# EAGLE design pro-one-mix-and-modified-noise_2 (EAGLE 5.07)
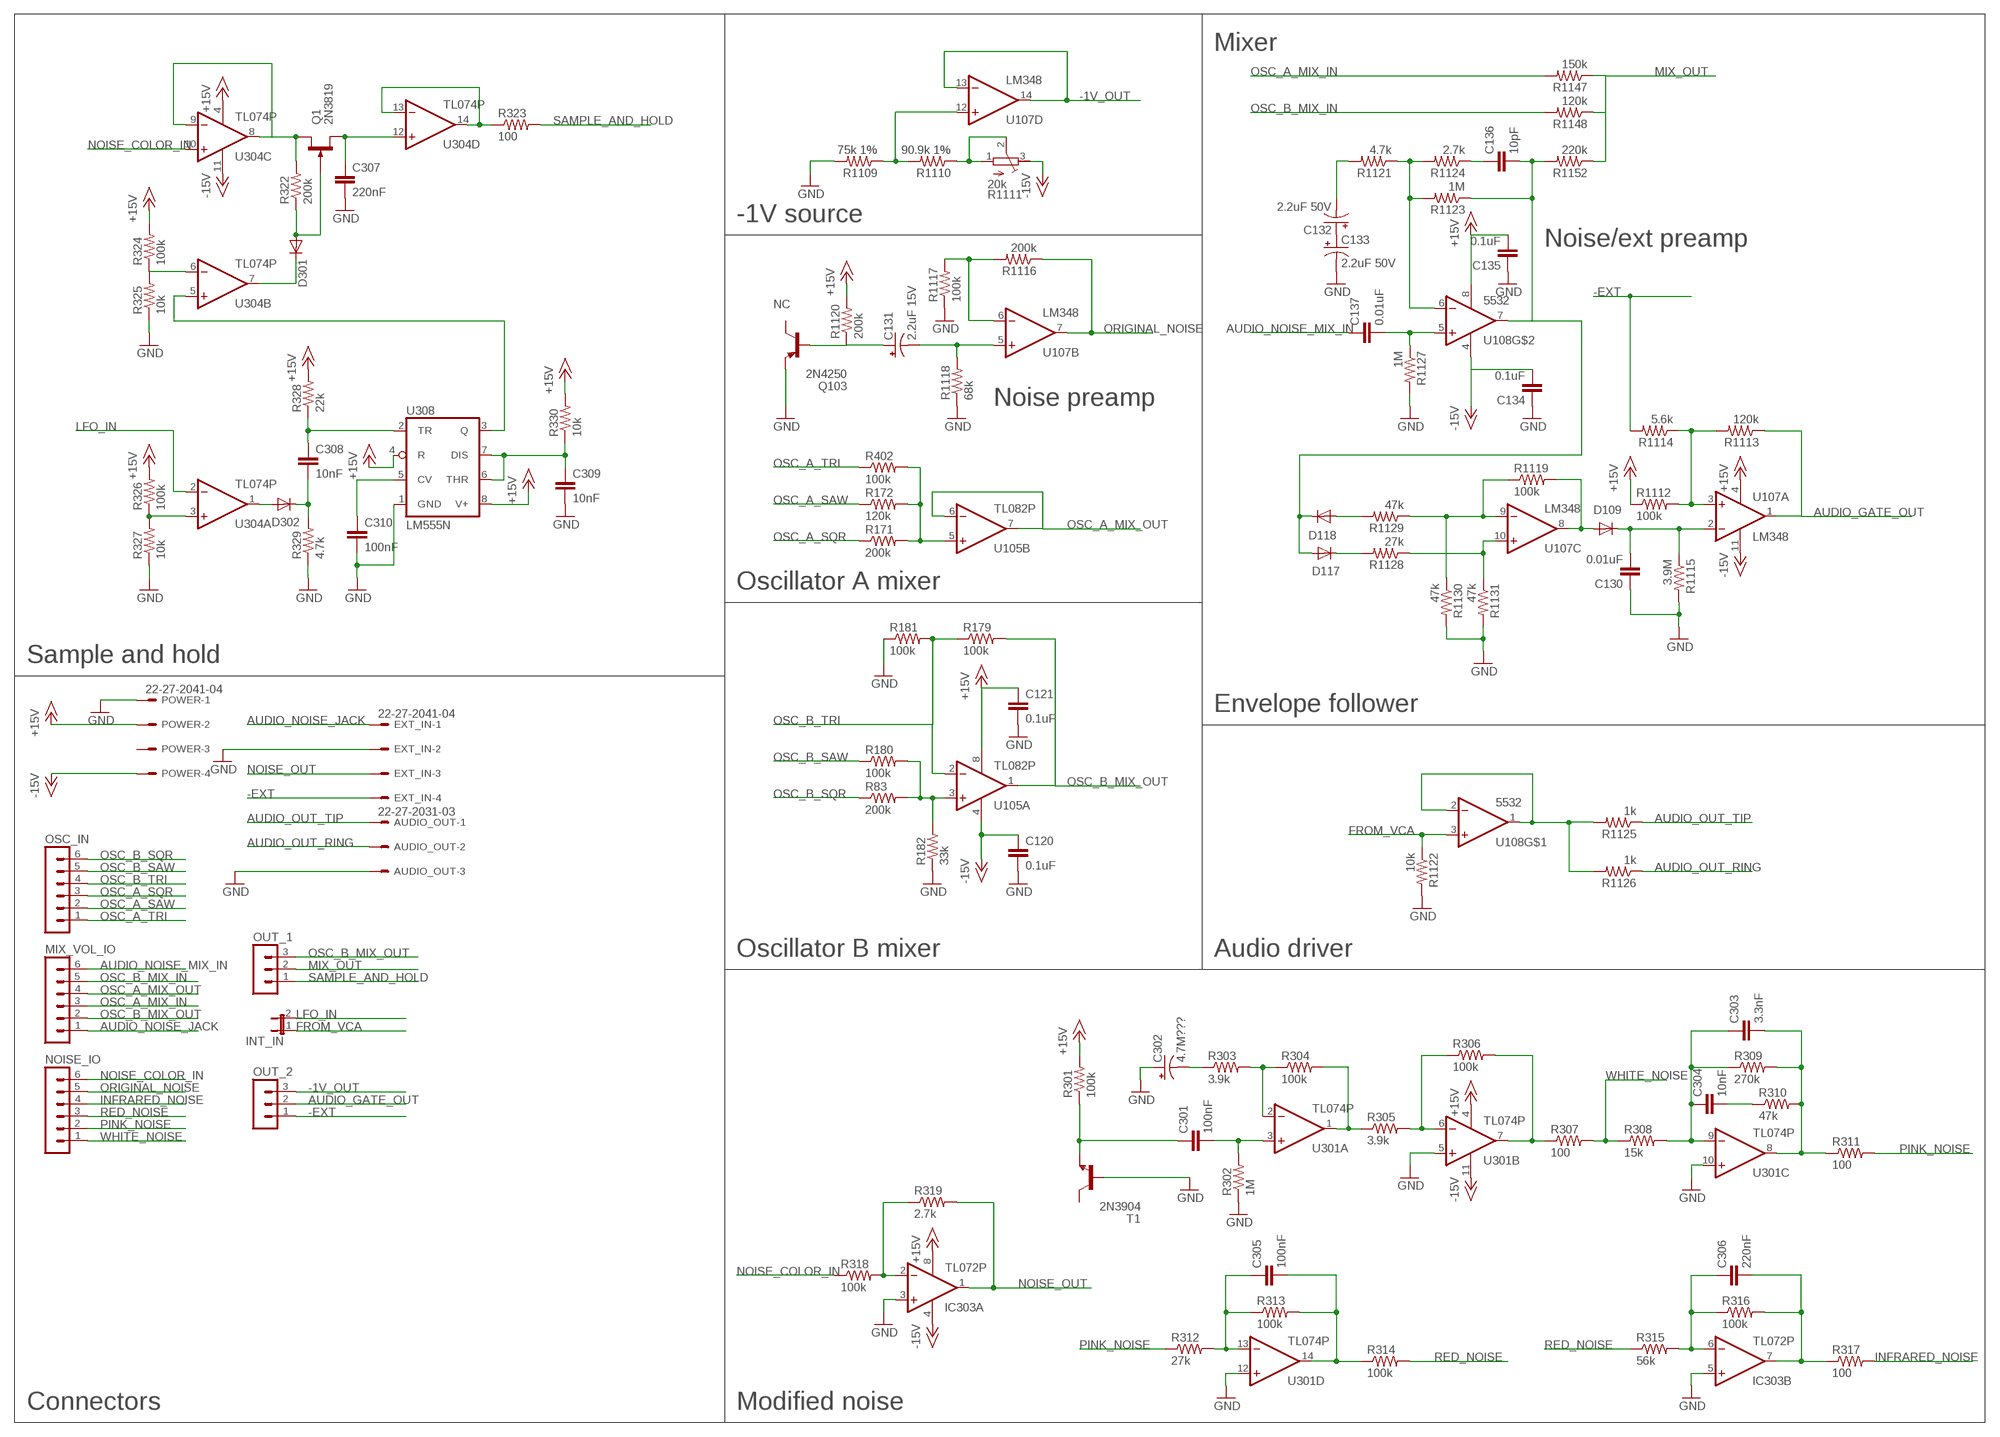
[diagram p0: schematic, sheet 1]

## Parts
AUDIO_OUT  22-27-2031-03  [6410-03]
C120  0.1uF  C-EU050-025X075  [C050-025X075]
C121  0.1uF  C-EU050-025X075  [C050-025X075]
C130  0.01uF  C-EU050-025X075  [C050-025X075]
C131  2.2uF 15V  CPOL-USE2.5-5  [E2,5-5]
C132  2.2uF 50V  CPOL-USE2.5-5  [E2,5-5]
C133  2.2uF 50V  CPOL-USE2.5-5  [E2,5-5]
C134  0.1uF  C-EU050-025X075  [C050-025X075]
C135  0.1uF  C-EU050-025X075  [C050-025X075]
C136  10pF  C-EU050-025X075  [C050-025X075]
C137  0.01uF  C-EU050-025X075  [C050-025X075]
C301  100nF  C-EU050-025X075  [C050-025X075]
C302  4.7M???  CPOL-USE2.5-5  [E2,5-5]
C303  3.3nF  C-EU050-025X075  [C050-025X075]
C304  10nF  C-EU050-025X075  [C050-025X075]
C305  100nF  C-EU050-025X075  [C050-025X075]
C306  220nF  C-EU050-025X075  [C050-025X075]
C307  220nF  C-EU050-025X075  [C050-025X075]
C308  10nF  C-EU050-025X075  [C050-025X075]
C309  10nF  C-EU050-025X075  [C050-025X075]
C310  100nF  C-EU050-025X075  [C050-025X075]
D109  1N4148DO35-7  [DO35-7]
D117  1N4148DO35-7  [DO35-7]
D118  1N4148DO35-7  [DO35-7]
D301  1N4148DO35-7  [DO35-7]
D302  1N4148DO35-7  [DO35-7]
EXT_IN  22-27-2041-04  [6410-04]
IC303  TL072P  [DIL08]
INT_IN  JP1E  [JP1]
MIX_VOL_IO  MA06-1  [MA06-1]
NOISE_IO  MA06-1  [MA06-1]
OSC_IN  MA06-1  [MA06-1]
OUT_1  MA03-1  [MA03-1]
OUT_2  MA03-1  [MA03-1]
POWER  22-27-2041-04  [6410-04]
Q1  2N3819  [TO92F]
Q103  2N4250  [TO92]
R83  200k  R-US_0309/10  [0309/10]
R171  200k  R-US_0309/10  [0309/10]
R172  120k  R-US_0309/10  [0309/10]
R179  100k  R-US_0309/10  [0309/10]
R180  100k  R-US_0309/10  [0309/10]
R181  100k  R-US_0309/10  [0309/10]
R182  33k  R-US_0309/10  [0309/10]
R301  100k  R-US_0309/10  [0309/10]
R302  1M  R-US_0309/10  [0309/10]
R303  3.9k  R-US_0309/10  [0309/10]
R304  100k  R-US_0309/10  [0309/10]
R305  3.9k  R-US_0309/10  [0309/10]
R306  100k  R-US_0309/10  [0309/10]
R307  100  R-US_0309/10  [0309/10]
R308  15k  R-US_0309/10  [0309/10]
R309  270k  R-US_0309/10  [0309/10]
R310  47k  R-US_0309/10  [0309/10]
R311  100  R-US_0309/10  [0309/10]
R312  27k  R-US_0309/10  [0309/10]
R313  100k  R-US_0309/10  [0309/10]
R314  100k  R-US_0309/10  [0309/10]
R315  56k  R-US_0309/10  [0309/10]
R316  100k  R-US_0309/10  [0309/10]
R317  100  R-US_0309/10  [0309/10]
R318  100k  R-US_0309/10  [0309/10]
R319  2.7k  R-US_0309/10  [0309/10]
R322  200k  R-US_0309/10  [0309/10]
R323  100  R-US_0309/10  [0309/10]
R324  100k  R-US_0309/10  [0309/10]
R325  10k  R-US_0309/10  [0309/10]
R326  100k  R-US_0309/10  [0309/10]
R327  10k  R-US_0309/10  [0309/10]
R328  22k  R-US_0309/10  [0309/10]
R329  4.7k  R-US_0309/10  [0309/10]
R330  10k  R-US_0309/10  [0309/10]
R402  100k  R-US_0309/10  [0309/10]
R1109  75k 1%  R-US_0309/10  [0309/10]
R1110  90.9k 1%  R-US_0309/10  [0309/10]
R1111  20k  R-TRIMM64W  [RTRIM64W]
R1112  100k  R-US_0309/10  [0309/10]
R1113  120k  R-US_0309/10  [0309/10]
R1114  5.6k  R-US_0309/10  [0309/10]
R1115  3.9M  R-US_0309/10  [0309/10]
R1116  200k  R-US_0309/10  [0309/10]
R1117  100k  R-US_0309/10  [0309/10]
R1118  68k  R-US_0309/10  [0309/10]
R1119  100k  R-US_0309/10  [0309/10]
R1120  200k  R-US_0309/10  [0309/10]
R1121  4.7k  R-US_0309/10  [0309/10]
R1122  10k  R-US_0309/10  [0309/10]
R1123  1M  R-US_0309/10  [0309/10]
R1124  2.7k  R-US_0309/10  [0309/10]
R1125  1k  R-US_0309/10  [0309/10]
R1126  1k  R-US_0309/10  [0309/10]
R1127  1M  R-US_0309/10  [0309/10]
R1128  27k  R-US_0309/10  [0309/10]
R1129  47k  R-US_0309/10  [0309/10]
R1130  47k  R-US_0309/10  [0309/10]
R1131  47k  R-US_0309/10  [0309/10]
R1147  150k  R-US_0309/10  [0309/10]
R1148  120k  R-US_0309/10  [0309/10]
R1152  220k  R-US_0309/10  [0309/10]
T1  2N3904  [TO92]
U105  TL082P  [DIL08]
U107  LM348  [DIL14]
U108  5532  [DIL08]
U301  TL074P  [DIL14]
U304  TL074P  [DIL14]
U308  LM555N  [DIL08]

## Nets
+15V: C121.1 C135.2 IC303.8(P:V+) POWER.2 R301.2 R324.2 R326.2 R328.2 R330.2 R1112.1 R1120.2 U105.8(P:V+) U107.4(P:V+) U108.8(V+) U301.4(P:V+) U304.4(P:V+) U308.4(R) U308.8(V+)
-1V_OUT: OUT_2.3 U107.13(D:-IN) U107.14(D:OUT)
-15V: C120.1 C134.2 IC303.4(P:V-) POWER.4 R1111.3(A) U105.4(P:V-) U107.11(P:V-) U108.4(V-) U301.11(P:V-) U304.11(P:V-)
-EXT: EXT_IN.4 OUT_2.1 R1114.2
AUDIO_GATE_OUT: OUT_2.2 R1113.1 U107.1(A:OUT)
AUDIO_NOISE_JACK: EXT_IN.1 MIX_VOL_IO.1
AUDIO_NOISE_MIX_IN: C137.1 MIX_VOL_IO.6
AUDIO_OUT_RING: AUDIO_OUT.2 R1126.1
AUDIO_OUT_TIP: AUDIO_OUT.1 R1125.1
FROM_VCA: INT_IN.1 R1122.1 U108.3(+IN)
GND: AUDIO_OUT.3 C120.2 C121.2 C130.1 C133.- C134.1 C135.1 C302.+ C307.2 C309.2 C310.2 EXT_IN.2 IC303.3(A:+IN) IC303.5(B:+IN) POWER.1 Q103.3(E) R181.1 R182.1 R302.1 R325.1 R327.1 R329.1 R1109.2 R1115.2 R1117.1 R1118.1 R1122.2 R1127.2 R1130.2 R1131.2 T1.2(B) U301.5(B:+IN) U301.10(C:+IN) U301.12(D:+IN) U308.1(GND)
INFRARED_NOISE: NOISE_IO.4 R317.2
LFO_IN: INT_IN.2 U304.2(A:-IN)
MIX_OUT: OUT_1.2 R1147.1 R1148.1 R1152.1
N$1: R171.2 R172.2 R402.2 U105.5(B:+IN)
N$2: R83.2 R180.2 R182.2 U105.3(A:+IN)
N$3: C131.- R1118.2 U107.5(B:+IN)
N$4: C131.+ Q103.2(B) R1120.1
N$5: R1116.2 R1117.2 U107.6(B:-IN)
N$6: C132.+ C133.+
N$7: R1109.1 R1110.2 U107.12(D:+IN)
N$8: R1110.1 R1111.1(E) R1111.2(S)
N$9: C132.- R1121.2
N$10: D118.A R1129.2
N$11: C136.1 R1124.1
N$12: C136.2 D117.A D118.C R1123.1 R1152.2 U108.7(OUT)
N$13: C137.2 R1127.1 U108.5(+IN)
N$14: R1121.1 R1123.2 R1124.2 U108.6(-IN)
N$15: D117.C R1128.2
N$16: R1119.1 R1129.1 R1130.1 U107.9(C:-IN)
N$17: R1128.1 R1131.1 U107.10(C:+IN)
N$18: R1112.2 R1113.2 R1114.1 U107.3(A:+IN)
N$19: R1125.2 R1126.2 U108.1(OUT) U108.2(-IN)
N$20: C301.1 R301.1 T1.3(E)
N$21: D109.A R1119.2 U107.8(C:OUT)
N$22: C130.2 D109.C R1115.1 U107.2(A:-IN)
N$23: C301.2 R302.2 U301.3(A:+IN)
N$24: C302.- R303.1
N$25: R303.2 R304.1 U301.2(A:-IN)
N$26: R304.2 R305.1 U301.1(A:OUT)
N$27: R305.2 R306.1 U301.6(B:-IN)
N$28: C305.1 R312.2 R313.1 U301.13(D:-IN)
N$29: R306.2 R307.1 U301.7(B:OUT)
N$30: C305.2 R313.2 R314.1 U301.14(D:OUT)
N$31: C303.1 C304.1 R308.2 R309.1 U301.9(C:-IN)
N$32: C306.1 IC303.6(B:-IN) R315.2 R316.1
N$33: C304.2 R310.1
N$34: C303.2 R309.2 R310.2 R311.1 U301.8(C:OUT)
N$35: C306.2 IC303.7(B:OUT) R316.2 R317.1
N$36: R324.1 R325.2 U304.6(B:-IN)
N$37: IC303.2(A:-IN) R318.2 R319.1
N$38: R326.1 R327.2 U304.3(A:+IN)
N$39: D302.A U304.1(A:OUT)
N$40: C308.2 D302.C R329.2
N$41: C308.1 R328.1 U308.2(TR)
N$42: U304.5(B:+IN) U308.3(Q)
N$43: C310.1 U308.5(CV)
N$44: C309.1 R330.1 U308.6(THR) U308.7(DIS)
N$45: D301.C U304.7(B:OUT)
N$46: D301.A Q1.G R322.1
N$47: Q1.D R322.2 U304.8(C:OUT) U304.9(C:-IN)
N$48: C307.1 Q1.S U304.12(D:+IN)
N$49: R323.1 U304.13(D:-IN) U304.14(D:OUT)
NOISE_COLOR_IN: NOISE_IO.6 R318.1 U304.10(C:+IN)
NOISE_OUT: EXT_IN.3 IC303.1(A:OUT) R319.2
ORIGINAL_NOISE: NOISE_IO.5 R1116.1 U107.7(B:OUT)
OSC_A_MIX_IN: MIX_VOL_IO.3 R1147.2
OSC_A_MIX_OUT: MIX_VOL_IO.4 U105.6(B:-IN) U105.7(B:OUT)
OSC_A_SAW: OSC_IN.2 R172.1
OSC_A_SQR: OSC_IN.3 R171.1
OSC_A_TRI: OSC_IN.1 R402.1
OSC_B_MIX_IN: MIX_VOL_IO.5 R1148.2
OSC_B_MIX_OUT: MIX_VOL_IO.2 OUT_1.3 R179.2 U105.1(A:OUT)
OSC_B_SAW: OSC_IN.5 R180.1
OSC_B_SQR: OSC_IN.6 R83.1
OSC_B_TRI: OSC_IN.4 R179.1 R181.2 U105.2(A:-IN)
PINK_NOISE: NOISE_IO.2 R311.2 R312.1
RED_NOISE: NOISE_IO.3 R314.2 R315.1
SAMPLE_AND_HOLD: OUT_1.1 R323.2
WHITE_NOISE: NOISE_IO.1 R307.2 R308.1
Unconnected: POWER.3 Q103.1(C) T1.1(C)

## Notes on the sheet
- Mixer
- -1V source
- Noise/ext preamp
- NC
- Noise preamp
- Oscillator A mixer
- Sample and hold
- Envelope follower
- Oscillator B mixer | Audio driver
- Connectors | Modified noise

## Library data of the parts
AUDIO_OUT = con-molex:22-?-03: CONNECTOR wire to board 2.54 mm (.1 inch) pitch header
C120 C121 C130 C134-C137 C301 C303-C310 = resistor:C-EU: CAPACITOR, European symbol
C131-C133 C302 = rcl:CPOL-US: POLARIZED CAPACITOR, American symbol
D109 D117 D118 D301 D302 = diode:1N4148: DIODE high speed (Philips)
EXT_IN POWER = con-molex:22-?-04: CONNECTOR wire to board 2.54 mm (.1 inch) pitch header
IC303 = linear:TL072: OP AMP
INT_IN = jumper:JP1E: JUMPER
MIX_VOL_IO NOISE_IO OSC_IN = con-lstb:MA06-1: PIN HEADER
OUT_1 OUT_2 = con-lstb:MA03-1: PIN HEADER
Q1 = transistor-small-signal:2N3819: N-CHANNEL FET
Q103 = joakim:2N4250: PNP Transistor
R83 R171 R172 R179-R182 R301-R319 R322-R330 R402 R1109 R1110 R1112-R1131 R1147 R1148 R1152 = resistor:R-US_: RESISTOR, American symbol
R1111 = resistor:R-TRIMM: Trimm resistor
T1 = transistor:2N3904: NPN TRANSISTOR
U105 = linear:TL082: OP AMP
U107 = joakim:LM348: Quad General Purpose, Low Voltage, Operational Amplifiers
U108 = joakim:5532: DUAL LOW-NOISE OPERATIONAL AMPLIFIERS
U301 U304 = linear:TL074: OP AMP
U308 = linear:*555: TIMER

## Board
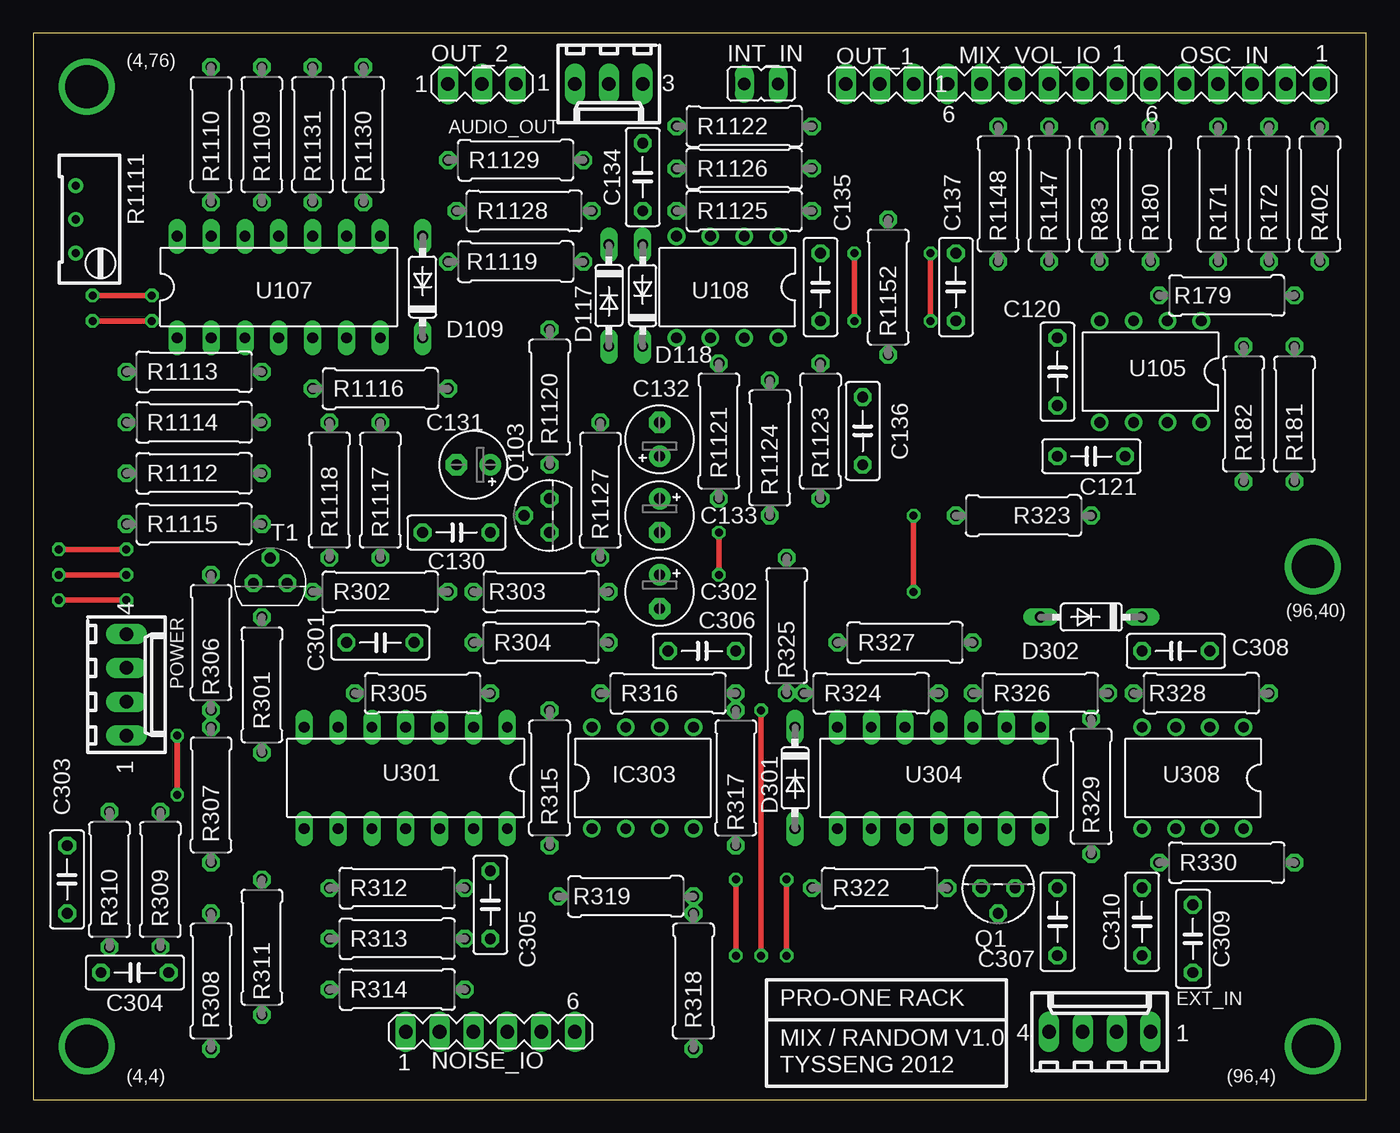
[diagram p1: board, top side]
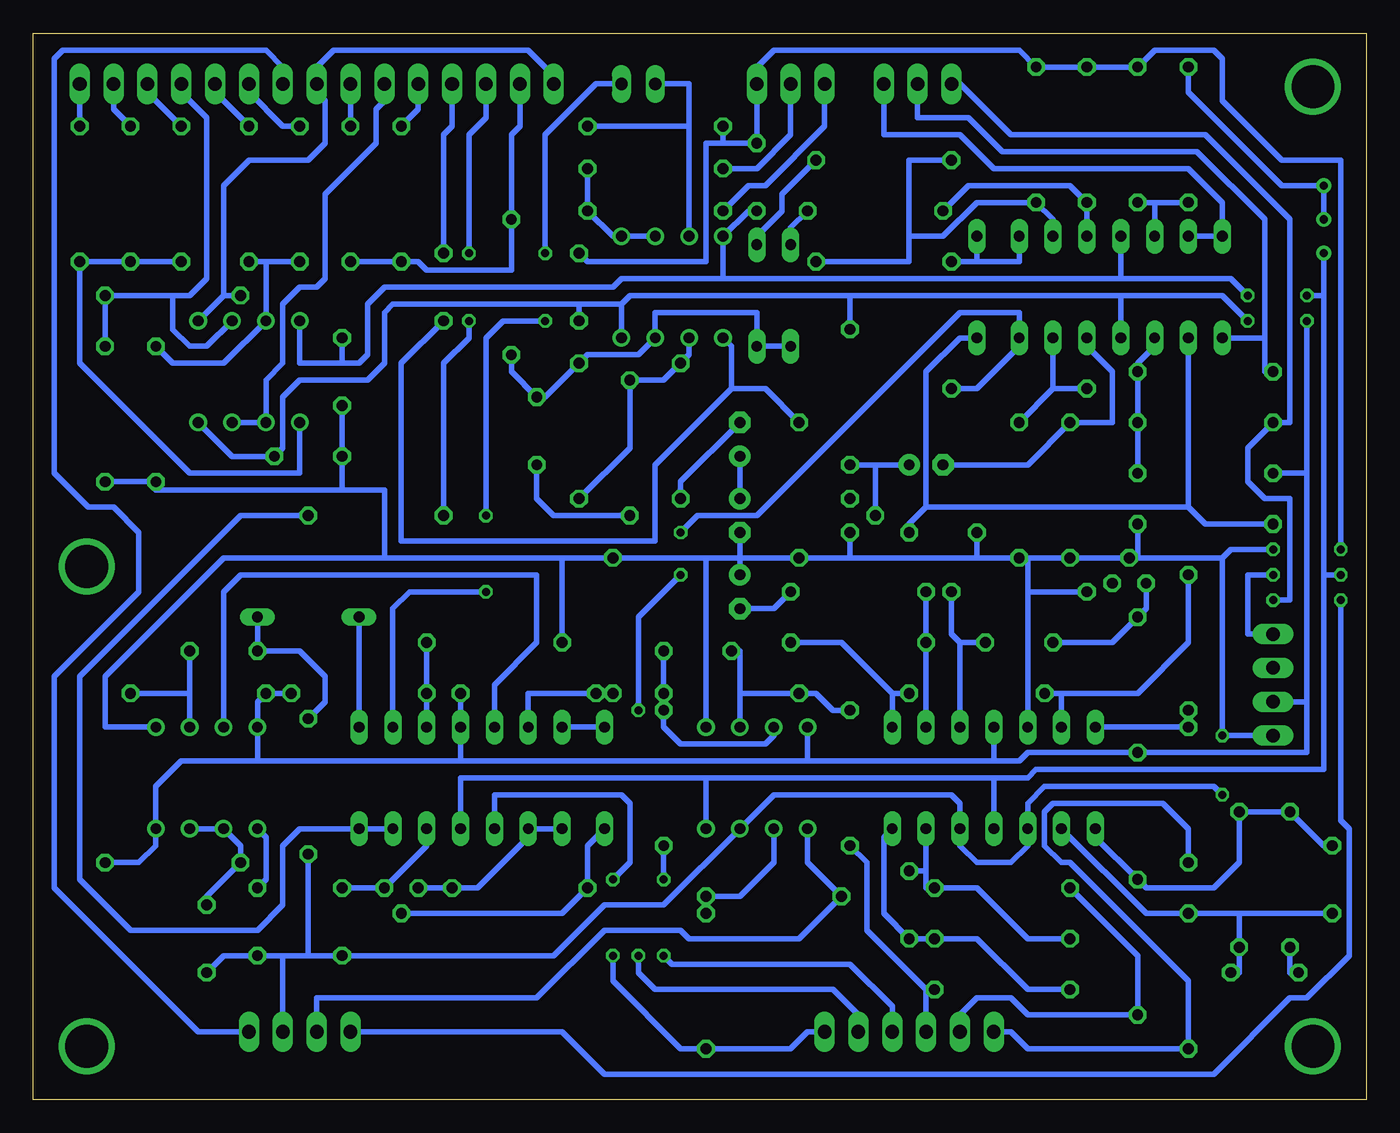
[diagram p2: board, bottom side, seen from below]

Size 100 x 80 mm. Coordinates in mm from the lower left corner, seen from the top.
Outline: 0,0 100,0 100,80 0,80 0,0
Copper layers (1*16): Top 0.035mm / dielectric 1.5mm / Bottom 0.035mm
Design rules "default *": minimum track width 10mil, minimum drill 24mil, track to track 8mil, track to pad 8mil, pad to pad 8mil, via to via 8mil, smd to smd 8mil, copper to edge 40mil, drill to drill 8mil, minimum pad ring 10mil, minimum via ring 8mil, stop-mask expansion 4mil, vias tented up to drill 0mil, thermal gap 10mil

### Footprints (pad centres in the part's own frame; a part is rotated, then mirrored left to right if it is on the bottom)
6410-03 = drill 1.016 long: 1 2.54,0; 2 0,0; 3 -2.54,0
C050-025X075 = drill 0.813 octagon: 1 -2.54,0; 2 2.54,0
E2,5-5 = drill 0.813 pad 1.6 round: + -1.27,0 | drill 0.813 pad 1.6 octagon: - 1.27,0
DO35-7 = drill 0.813 long: A 3.81,0; C -3.81,0
6410-04 = drill 1.016 long: 1 3.81,0; 2 1.27,0; 3 -1.27,0; 4 -3.81,0
DIL08 = drill 0.813 pad 1.27 round: 1 -3.81,-3.81; 2 -1.27,-3.81; 3 1.27,-3.81; 4 3.81,-3.81; 5 3.81,3.81; 6 1.27,3.81; 7 -1.27,3.81; 8 -3.81,3.81
JP1 = drill 0.914 long: 1 0,-1.27; 2 0,1.27
MA06-1 = drill 1.016 long: 1 -6.35,0; 2 -3.81,0; 3 -1.27,0; 4 1.27,0; 5 3.81,0; 6 6.35,0
MA03-1 = drill 1.016 long: 1 -2.54,0; 2 0,0; 3 2.54,0
TO92F = drill 0.813 octagon: D 1.27,0; G 0,1.905; S -1.27,0
TO92 = drill 0.813 octagon: 1 1.27,0; 2 0,1.905; 3 -1.27,0
0309/10 = drill 0.813 octagon: 1 -5.08,0; 2 5.08,0
RTRIM64W = drill 0.61 round: 1 1.27,-2.54; 2 1.27,0; 3 1.27,2.54
DIL14 = drill 0.813 long: 1 -7.62,-3.81; 2 -5.08,-3.81; 3 -2.54,-3.81; 4 0,-3.81; 5 2.54,-3.81; 6 5.08,-3.81; 7 7.62,-3.81; 8 7.62,3.81; 9 5.08,3.81; 10 2.54,3.81; 11 0,3.81; 12 -2.54,3.81; 13 -5.08,3.81; 14 -7.62,3.81

### Placement (x,y rotation side)
AUDIO_OUT  43.18,76.2 180 top
C120  76.83,54.61 270 top
C121  79.38,48.26 180 top
C130  31.75,42.55 0 top
C131  33.02,47.62 180 top
C132  46.99,49.53 90 top
C133  46.99,43.81 270 top
C134  45.72,69.22 270 top
C135  59.05,60.96 270 top
C136  62.23,50.16 90 top
C137  69.22,60.96 270 top
C301  26.04,34.29 0 top
C302  46.99,38.1 270 top
C303  2.54,16.51 90 top
C304  7.62,9.53 180 top
C305  34.29,14.61 270 top
C306  50.16,33.66 0 top
C307  76.83,13.34 270 top
C308  85.72,33.66 180 top
C309  87,12.06 270 top
C310  83.19,13.34 270 top
D109  29.21,60.96 90 top
D117  43.18,60.33 270 top
D118  45.72,60.33 90 top
D301  57.15,24.13 270 top
D302  79.38,36.2 180 top
EXT_IN  80.01,5.08 0 top
IC303  45.72,24.13 0 top
INT_IN  54.61,76.2 270 top
MIX_VOL_IO  74.93,76.2 180 top
NOISE_IO  34.29,5.08 0 top
OSC_IN  90.17,76.2 180 top
OUT_1  63.5,76.2 180 top
OUT_2  33.66,76.2 0 top
POWER  6.99,31.11 270 top
Q1  72.39,15.88 180 top
Q103  38.73,43.81 90 top
R83  80.01,67.94 270 top
R171  88.9,67.94 270 top
R172  92.71,67.94 270 top
R179  89.53,60.33 180 top
R180  83.82,67.94 270 top
R181  94.61,51.44 90 top
R182  90.81,51.44 90 top
R301  17.14,31.11 270 top
R302  26.04,38.1 0 top
R303  38.1,38.1 180 top
R304  38.1,34.29 0 top
R305  29.21,30.48 180 top
R306  13.34,34.29 270 top
R307  13.34,22.86 270 top
R308  13.34,8.89 90 top
R309  9.53,16.51 90 top
R310  5.71,16.51 90 top
R311  17.14,11.43 270 top
R312  27.3,15.88 0 top
R313  27.3,12.06 0 top
R314  27.3,8.26 0 top
R315  38.73,24.13 90 top
R316  47.62,30.48 0 top
R317  52.7,24.13 270 top
R318  49.53,8.89 90 top
R319  44.45,15.24 180 top
R322  63.5,15.88 0 top
R323  74.3,43.81 180 top
R324  62.87,30.48 0 top
R325  56.52,35.56 270 top
R326  75.56,30.48 0 top
R327  65.41,34.29 0 top
R328  87.63,30.48 180 top
R329  79.38,23.5 90 top
R330  89.53,17.78 0 top
R402  96.52,67.94 270 top
R1109  17.14,72.39 90 top
R1110  13.34,72.39 270 top
R1111  4.45,66.04 180 top
R1112  12.06,46.99 0 top
R1113  12.06,54.61 0 top
R1114  12.06,50.8 180 top
R1115  12.06,43.18 0 top
R1116  26.04,53.34 180 top
R1117  26.04,45.72 90 top
R1118  22.23,45.72 90 top
R1119  36.2,62.87 180 top
R1120  38.73,52.7 90 top
R1121  51.44,50.16 270 top
R1122  53.34,73.03 180 top
R1123  59.05,50.16 270 top
R1124  55.24,48.9 90 top
R1125  53.34,66.67 0 top
R1126  53.34,69.85 0 top
R1127  42.55,45.72 270 top
R1128  36.83,66.67 0 top
R1129  36.2,70.48 0 top
R1130  24.77,72.39 90 top
R1131  20.95,72.39 90 top
R1147  76.2,67.94 90 top
R1148  72.39,67.94 90 top
R1152  64.14,60.96 270 top
T1  17.78,38.73 0 top
U105  83.82,54.61 180 top
U107  18.41,60.96 0 top
U108  52.07,60.96 180 top
U301  27.94,24.13 180 top
U304  67.94,24.13 180 top
U308  87,24.13 180 top

### Tracks (layer width: path | path; a pad name or v marks a point on that pad's centre or on a via)
+15V  (via drill 0.6)
  Top 0.406: v4.45,58.42 v8.89,58.42
  Bottom 0.406: 18.41,60.33 38.73,60.33 | 18.41,60.33 U107.4 | 27.94,25.4 41.91,25.4 | 41.91,25.4 67.94,25.4 | 67.94,25.4 83.19,25.4 | 27.94,25.4 U301.4 | 67.94,25.4 U304.4 R324.2 | 4.45,46.99 v4.45,58.42 | 4.45,29.84 4.45,26.04 R301.2 25.4,26.04 26.04,25.4 27.94,25.4 | R330.2 92.08,17.78 90.81,19.05 U308.8 90.81,23.5 88.9,25.4 83.19,25.4 | 83.19,25.4 U308.4 83.19,29.84 R328.2 R326.2 | 41.91,25.4 IC303.8 | 4.45,46.99 R1112.1 | U105.8 85.09,48.26 C121.1 81.28,48.9 81.28,52.7 80.01,53.98 74.93,53.98 73.66,55.24 73.66,59.05 73.03,59.69 59.05,59.69 | v8.89,58.42 10.79,60.33 18.41,60.33 | 4.45,29.84 POWER.2 | 4.45,29.84 4.45,46.99 | 38.73,60.33 R1120.2 | 55.88,59.69 U108.8 | 38.73,60.33 55.24,60.33 55.88,59.69 | 55.88,59.69 59.05,59.69 | 59.05,59.69 C135.2
-1V_OUT
  Bottom 0.406: U107.13 U107.14 10.79,67.31 13.34,69.85 27.94,69.85 30.48,72.39 36.2,72.39 OUT_2.3
-15V  (via drill 0.6)
  Top 0.406: v4.45,60.33 v8.89,60.33 | v1.91,39.37 v6.99,39.37
  Bottom 0.406: 18.41,61.59 U107.11 | U304.11 67.94,24.13 49.53,24.13 | 27.94,24.13 49.53,24.13 | 27.94,24.13 U301.11 | 49.53,24.13 IC303.4 | 3.17,60.33 R1111.3 | U105.4 80.01,55.24 76.83,55.24 | 48.26,61.59 U108.4 46.35,66.67 C134.2 | 76.83,55.24 C120.1 | 48.26,61.59 55.88,61.59 56.52,60.96 73.66,60.96 74.93,59.69 74.93,55.88 75.56,55.24 76.83,55.24 | v8.89,60.33 10.16,61.59 18.41,61.59 | 3.17,39.37 3.17,24.77 24.77,24.77 25.4,24.13 27.94,24.13 | 3.17,39.37 3.17,60.33 | 3.17,60.33 v4.45,60.33 | v6.99,39.37 8.89,39.37 8.89,34.92 POWER.4 | 3.17,39.37 v1.91,39.37 | 18.41,61.59 48.26,61.59
-EXT  (via drill 0.6)
  Top 0.406: v1.91,37.47 v6.99,37.47
  Bottom 0.406: v6.99,37.47 5.71,37.47 5.71,45.09 7.62,45.09 8.89,46.35 8.89,48.9 R1114.2 5.71,50.8 5.71,66.04 12.06,72.39 26.67,72.39 30.48,76.2 OUT_2.1 | v1.91,37.47 1.91,20.95 1.27,20.32 1.27,10.79 4.45,7.62 5.71,7.62 11.43,1.91 57.15,1.91 60.33,5.08 EXT_IN.4
AUDIO_GATE_OUT
  Bottom 0.406: 7.62,57.15 U107.1 | 7.62,57.15 7.62,66.04 12.7,71.12 27.3,71.12 29.84,73.66 33.66,73.66 OUT_2.2 | R1113.1 7.62,54.61 7.62,57.15
AUDIO_NOISE_JACK
  Bottom 0.406: EXT_IN.1 87.63,5.08 98.42,15.88 98.42,31.75 92.08,38.1 92.08,42.55 93.98,44.45 95.89,44.45 98.42,46.99 98.42,78.11 97.79,78.74 82.55,78.74 81.28,77.47 MIX_VOL_IO.1
AUDIO_NOISE_MIX_IN
  Bottom 0.406: MIX_VOL_IO.6 68.58,73.03 69.22,72.39 C137.1
AUDIO_OUT_RING
  Bottom 0.406: R1126.1 45.72,69.85 43.18,72.39 AUDIO_OUT.2
AUDIO_OUT_TIP
  Bottom 0.406: R1125.1 46.35,68.58 45.09,68.58 40.64,73.03 AUDIO_OUT.1
FROM_VCA
  Bottom 0.406: U108.3 50.8,73.03 | 50.8,73.03 50.8,76.2 INT_IN.1 | 50.8,73.03 R1122.1
GND  (via drill 0.6)
  Top 0.406: v6.99,41.27 v1.91,41.27 | v10.79,27.3 v10.79,22.86
  Bottom 0.406: 81.28,10.79 C310.2 85.72,10.79 C309.2 | 79.38,10.79 R329.1 | POWER.1 v10.79,27.3 10.79,40.64 | U308.1 94.61,27.94 94.61,31.75 85.72,40.64 73.66,40.64 | 10.79,40.64 17.14,40.64 | 17.14,40.64 T1.2 R1118.1 25.4,40.64 | 46.99,40.64 R1127.2 38.73,40.64 | 49.53,40.64 IC303.5 | 79.38,10.79 C307.2 60.96,10.79 57.15,14.61 52.7,14.61 IC303.3 44.45,22.86 31.11,22.86 30.48,22.23 U301.12 30.48,19.05 29.21,17.78 26.67,17.78 25.4,19.05 U301.10 25.4,22.23 24.13,23.5 11.43,23.5 v10.79,22.86 | 79.38,10.79 81.28,10.79 | 25.4,40.64 25.4,38.1 | 25.4,38.1 U301.5 | 25.4,38.1 R302.1 | 29.21,40.64 R1117.1 25.4,40.64 | 29.21,40.64 38.73,40.64 | 49.53,40.64 R325.1 60.33,40.64 | 60.33,40.64 R327.1 | 29.21,40.64 C130.1 | 38.73,40.64 Q103.3 | 17.14,40.64 R1115.2 | v1.91,41.27 1.91,70.48 6.35,70.48 10.79,74.93 10.79,78.11 11.43,78.74 15.88,78.74 R1109.2 R1131.2 R1130.2 26.04,78.74 44.45,78.74 45.72,77.47 AUDIO_OUT.3 C134.1 48.26,71.75 | 46.99,40.64 C133.- | 60.33,40.64 73.66,40.64 | 10.79,40.64 10.16,41.27 v6.99,41.27 | C120.2 C121.2 76.83,45.72 | 81.28,10.79 EXT_IN.2 | R181.1 R182.1 90.81,45.72 76.83,45.72 | 76.83,45.72 73.66,45.72 73.66,40.64 | C135.1 58.42,62.87 49.53,62.87 49.53,71.75 48.26,71.75 | 48.26,71.75 R1122.2 | 46.99,40.64 C302.+ | 46.99,40.64 49.53,40.64
INFRARED_NOISE  (via drill 0.6)
  Top 0.406: v52.7,10.79 v52.7,16.51
  Bottom 0.406: v52.7,16.51 R317.2 | v52.7,10.79 52.07,10.16 38.73,10.16 35.56,6.99 NOISE_IO.4
LFO_IN  (via drill 0.6)
  Top 0.406: v66.04,38.1 v66.04,43.81 | v61.59,58.42 v61.59,63.5
  Bottom 0.406: U304.2 73.03,36.83 71.75,38.1 v66.04,38.1 | v66.04,43.81 66.04,57.15 64.77,58.42 v61.59,58.42 | v61.59,63.5 61.59,72.39 57.78,76.2 INT_IN.2
MIX_OUT
  Bottom 0.406: R1147.1 R1148.1 71.12,62.87 70.48,62.23 64.14,62.23 R1152.1 64.14,72.39 63.5,73.03 OUT_1.2
N$1
  Bottom 0.406: R171.2 R172.2 R402.2 96.52,55.24 88.27,46.99 80.01,46.99 U105.5
N$2
  Bottom 0.406: 82.55,62.87 R83.2 | 82.55,62.87 R180.2 | 82.55,62.87 U105.3 85.72,55.24 89.53,55.24 R182.2
N$3
  Bottom 0.406: U107.5 20.95,56.52 19.05,54.61 19.05,50.8 R1118.2 25.4,47.62 C131.-
N$4
  Bottom 0.406: 36.83,47.62 C131.+ | Q103.2 36.83,47.62 | 36.83,47.62 R1120.1
N$5
  Bottom 0.406: 23.5,53.34 U107.6 | R1116.2 23.5,53.34 | 23.5,53.34 R1117.2
N$6
  Bottom 0.406: C133.+ C132.+
N$7
  Bottom 0.406: 15.88,67.31 R1110.2 | 15.88,67.31 R1109.1 | U107.12 15.88,67.31
N$8
  Bottom 0.406: R1110.1 13.34,75.56 6.35,68.58 R1111.1 R1111.2
N$9
  Bottom 0.406: C132.- 51.44,46.35 R1121.2
N$10
  Bottom 0.406: R1129.2 43.81,67.94 43.81,66.67 45.72,64.77 D118.A
N$11
  Bottom 0.406: R1124.1 60.96,43.81 62.23,45.09 C136.1
N$12
  Bottom 0.406: D117.A D118.C 45.72,59.05 53.34,59.05 U108.7 54.61,55.88 58.42,55.88 R1123.1 61.59,52.7 C136.2 64.14,54.61 R1152.2
N$13
  Bottom 0.406: R1127.1 45.09,53.34 47.62,53.34 | U108.5 47.62,56.52 47.62,53.34 | C137.2 72.39,55.24 72.39,41.91 53.34,41.91 53.34,47.62 47.62,53.34
N$14
  Bottom 0.406: U108.6 50.8,55.88 R1121.1 52.7,53.98 R1124.2 55.24,48.9 R1123.2
N$15
  Bottom 0.406: R1128.2 43.18,65.41 D117.C
N$16
  Bottom 0.406: U107.9 23.5,66.04 R1130.1 29.21,67.31 31.75,64.77 34.29,64.77 | R1119.1 34.29,62.87 34.29,64.77 | 34.29,64.77 34.29,70.48 R1129.1
N$17
  Bottom 0.406: U107.10 R1131.1 22.23,68.58 29.84,68.58 R1128.1
N$18
  Bottom 0.406: U107.3 15.88,56.52 17.14,55.24 R1113.2 R1112.2 R1114.1
N$19
  Bottom 0.406: U108.2 U108.1 56.52,64.77 R1125.2 R1126.2
N$20
  Bottom 0.406: C301.1 19.05,34.29 R301.1 16.51,36.83 T1.3
N$21
  Bottom 0.406: 29.21,62.87 26.04,62.87 U107.8 | 29.21,62.87 D109.A | 29.21,62.87 R1119.2
N$22
  Bottom 0.406: D109.C 30.48,57.15 33.02,54.61 33.02,44.45 | R1115.1 12.06,43.18 13.34,44.45 | 13.34,44.45 33.02,44.45 | 33.02,44.45 34.29,43.18 C130.2 | 13.34,44.45 U107.2
N$23
  Bottom 0.406: U301.3 30.48,34.29 | 30.48,34.29 31.11,34.92 R302.2 | 30.48,34.29 C301.2
N$24
  Bottom 0.406: R303.1 44.45,36.83 C302.-
N$25
  Bottom 0.406: U301.2 R304.1 R303.2
N$26
  Bottom 0.406: 35.56,30.48 U301.1 | R305.1 35.56,30.48 | 35.56,30.48 39.37,34.29 R304.2
N$27
  Bottom 0.406: 22.86,30.48 U301.6 | 22.86,30.48 17.14,30.48 13.34,34.29 R306.1 | 22.86,30.48 R305.2
N$28
  Bottom 0.406: 33.02,17.14 U301.13 | 33.02,17.14 C305.1 | R313.1 25.4,12.06 29.21,15.88 R312.2 33.02,15.88 33.02,17.14
N$29
  Bottom 0.406: U301.7 R307.1 R306.2
N$30
  Bottom 0.406: R314.1 25.4,8.26 29.21,12.06 R313.2 C305.2 36.2,13.97 36.2,19.68 U301.14
N$31
  Bottom 0.406: C304.1 9.53,9.53 R309.1 9.53,13.97 | C303.1 9.53,13.97 | 9.53,13.97 R308.2 16.51,13.97 U301.9
N$32
  Bottom 0.406: 46.99,30.48 IC303.6 | 46.99,30.48 46.99,33.66 C306.1 | 46.99,30.48 R316.1 41.27,30.48 40.01,29.21 R315.2
N$33
  Bottom 0.406: C304.2 5.71,9.53 R310.1
N$34
  Bottom 0.406: C303.2 3.17,19.05 R310.2 R309.2 9.53,17.78 11.43,15.88 16.51,15.88 R311.1 20.32,19.68 U301.8
N$35
  Bottom 0.406: C306.2 R316.2 R317.1 52.7,27.94 51.44,26.67 45.09,26.67 44.45,27.3 IC303.7
N$36
  Bottom 0.406: R325.2 R324.1 62.87,30.48 U304.6
N$37
  Bottom 0.406: IC303.2 44.45,17.78 46.99,15.24 R319.1 R318.2
N$38
  Bottom 0.406: U304.3 R326.1 R327.2
N$39
  Bottom 0.406: U304.1 D302.A
N$40
  Bottom 0.406: R329.2 78.11,29.84 78.11,31.75 80.01,33.66 C308.2 D302.C
N$41
  Bottom 0.406: U308.2 88.27,30.48 | 88.27,30.48 R328.1 | 88.27,30.48 C308.1
N$42
  Bottom 0.406: U308.3 85.72,38.1 84.45,39.37 62.23,39.37 62.23,34.29 65.41,31.11 U304.5
N$43
  Bottom 0.406: C310.1 82.55,16.51 82.55,19.68 U308.5
N$44
  Bottom 0.406: U308.7 U308.6 84.45,19.05 R330.1 87,15.24 C309.1
N$45
  Bottom 0.406: D301.C U304.7
N$46
  Bottom 0.406: D301.A 58.42,19.05 R322.1 60.33,13.97 Q1.G
N$47
  Bottom 0.406: U304.8 U304.9 62.87,19.68 66.67,15.88 R322.2 Q1.D
N$48
  Bottom 0.406: U304.12 70.48,19.05 Q1.S C307.1
N$49
  Bottom 0.406: U304.13 U304.14 80.01,20.32 81.28,19.05 81.28,14.61 83.19,12.7 92.71,12.7 96.52,16.51 96.52,31.75 84.45,43.81 R323.1
N$50  (via drill 3.2)
  other vias: 4,4
N$51  (via drill 3.2)
  other vias: 4,76
N$52  (via drill 3.2)
  other vias: 96,4
N$53  (via drill 3.2)
  other vias: 96,40
NOISE_COLOR_IN  (via drill 0.6)
  Top 0.406: v56.52,10.79 v56.52,16.51
  Bottom 0.406: U304.10 65.41,22.86 55.88,22.86 55.24,22.23 55.24,17.78 v56.52,16.51 | v56.52,10.79 56.52,8.89 51.44,3.81 R318.1 43.18,3.81 41.91,5.08 NOISE_IO.6
NOISE_OUT
  Bottom 0.406: IC303.1 41.91,17.78 R319.2 42.55,12.06 50.8,12.06 51.44,12.7 57.15,12.7 62.23,7.62 78.74,7.62 EXT_IN.3
ORIGINAL_NOISE  (via drill 0.6)
  Top 0.406: v51.44,39.37 v51.44,42.55 | v54.61,10.79 v54.61,29.21
  Bottom 0.406: R1116.1 29.21,53.34 26.04,56.52 U107.7 26.04,59.05 30.48,59.05 45.72,43.81 50.16,43.81 v51.44,42.55 | v51.44,39.37 54.61,36.2 v54.61,29.21 | v54.61,10.79 54.61,9.53 53.34,8.26 40.01,8.26 38.1,6.35 NOISE_IO.5
OSC_A_MIX_IN
  Bottom 0.406: R1147.2 MIX_VOL_IO.3
OSC_A_MIX_OUT
  Bottom 0.406: U105.7 U105.6 82.55,53.98 81.28,55.24 81.28,59.69 80.01,60.96 78.74,60.96 78.11,61.59 78.11,67.94 74.3,71.75 74.3,74.3 73.66,74.93 MIX_VOL_IO.4
OSC_A_SAW
  Bottom 0.406: R172.1 93.98,74.3 OSC_IN.2
OSC_A_SQR
  Bottom 0.406: R171.1 91.44,75.56 OSC_IN.3
OSC_A_TRI
  Bottom 0.406: R402.1 OSC_IN.1
OSC_B_MIX_IN
  Bottom 0.406: R1148.2 71.12,74.3 MIX_VOL_IO.5
OSC_B_MIX_OUT
  Bottom 0.406: 85.72,60.33 U105.1 | 85.72,60.33 R179.2 | 85.72,60.33 85.72,68.58 83.82,70.48 79.38,70.48 78.11,71.75 78.11,74.93 78.74,75.56 MIX_VOL_IO.2 78.74,77.47 77.47,78.74 62.87,78.74 60.96,76.83 OUT_1.3
OSC_B_SAW
  Bottom 0.406: OSC_IN.5 86.36,75.56 R180.1
OSC_B_SQR
  Bottom 0.406: R83.1 81.28,73.03 83.82,75.56 OSC_IN.6
OSC_B_TRI
  Bottom 0.406: U105.2 87,56.52 88.27,56.52 89.53,57.78 89.53,60.33 | OSC_IN.4 88.9,75.56 87,73.66 87,61.59 88.27,60.33 89.53,60.33 | R181.2 R179.1 89.53,60.33
PINK_NOISE
  Bottom 0.406: NOISE_IO.2 30.48,6.35 29.21,7.62 26.67,7.62 25.4,6.35 R311.2 17.14,10.79 R312.1
RED_NOISE
  Bottom 0.406: 33.02,8.26 37.47,12.7 37.47,17.78 R315.1 | 33.02,8.26 R314.2 | NOISE_IO.3 33.02,8.26
SAMPLE_AND_HOLD  (via drill 0.6)
  Top 0.406: v67.31,58.42 v67.31,63.5
  Bottom 0.406: R323.2 69.22,55.24 67.31,57.15 v67.31,58.42 | v67.31,63.5 67.31,72.39 66.04,73.66 OUT_1.1
WHITE_NOISE
  Bottom 0.406: NOISE_IO.1 26.67,5.08 25.4,3.81 R308.1 13.34,8.89 22.23,17.78 22.86,17.78 24.13,19.05 24.13,21.59 23.5,22.23 15.24,22.23 13.34,20.32 R307.2

### Text on the board
tPlace: (4,76) | (96,40) | PRO-ONE RACK | MIX / RANDOM V1.0 | TYSSENG 2012 | (4,4) | (96,4)